# Altium schematic sheet demoBoard.SchDoc
size A4; SheetNumber: 1; SheetTotal: 1; SPICEModelCacheLQNEOJUH: <root> / <DocumentId>LQNEOJUH</DocumentId> / </root>
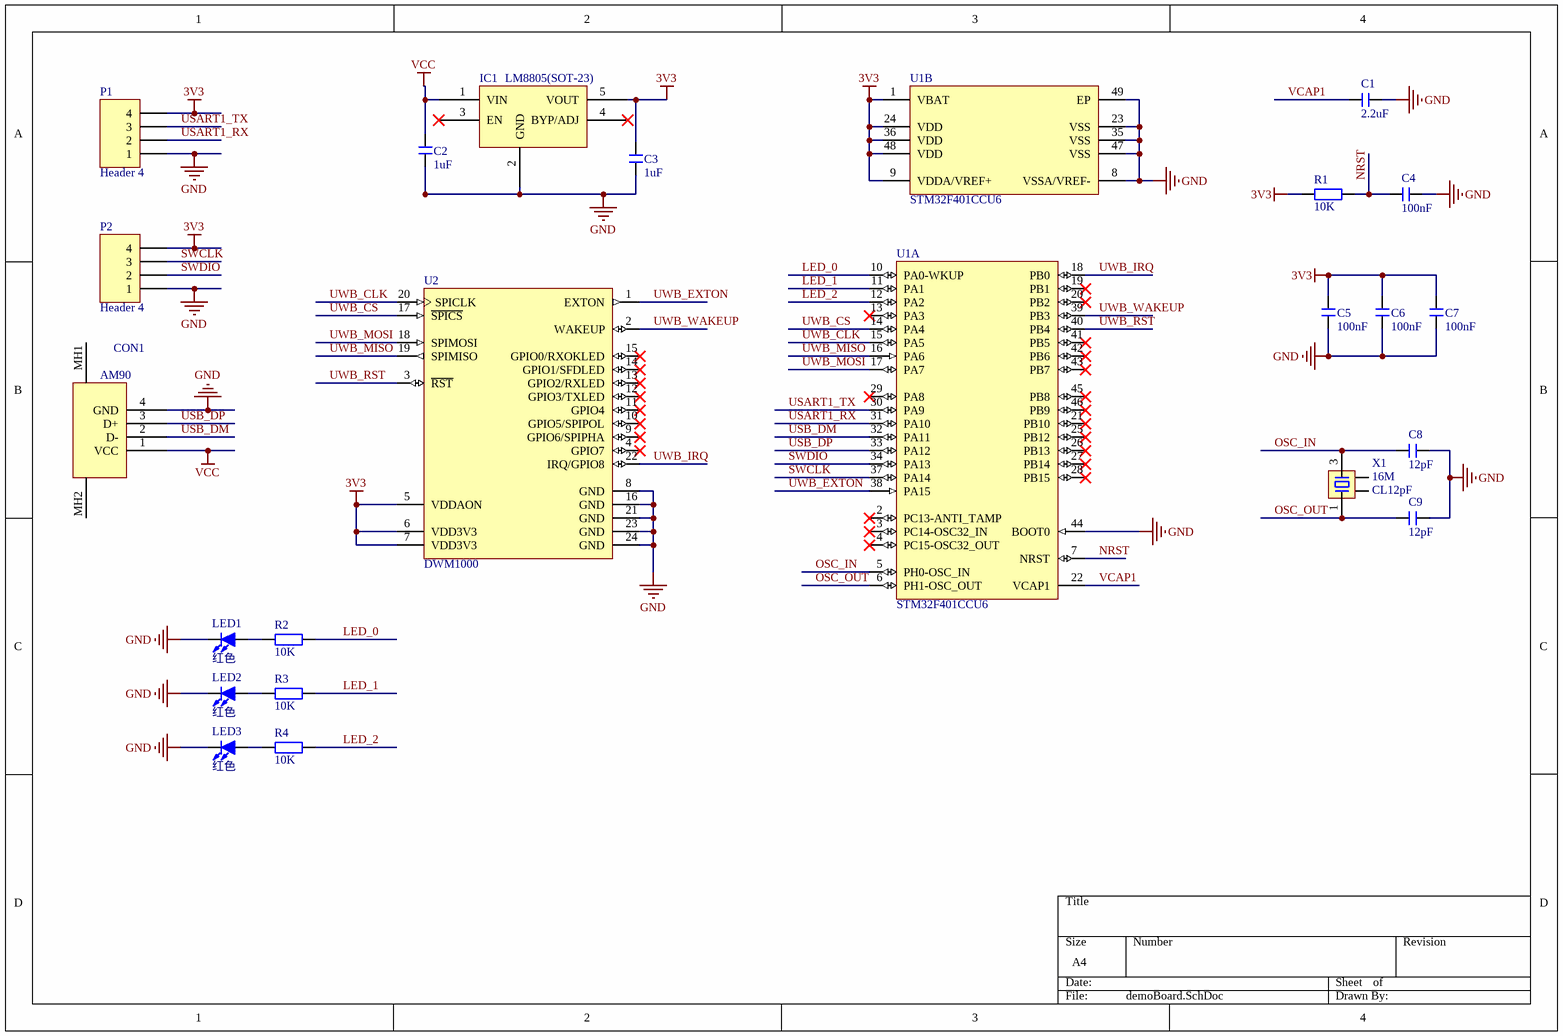
[diagram p0: demoBoard.SchDoc]

## Parts
C1  2.2uF  [C 0603_L]
C2  1uF  [C 0603_L]
C3  1uF  [C 0603_L]
C4  100nF  [C 0603_L]
C5  100nF  [C 0603_L]
C6  100nF  [C 0603_L]
C7  100nF  [C 0603_L]
C8  12pF  [C 0603_L]
C9  12pF  [C 0603_L]
CON1  AM90  [USB-AM-TH_AM90]
IC1  LM8805(SOT-23)  [SOT23-5N]
LED1  红色  [LED 0603G]
LED2  红色  [LED 0603G]
LED3  红色  [LED 0603G]
P1  Header 4  [MX 1.25-WS-4P]
P2  Header 4  [MX 1.25-WS-4P]
R1  10K  [R 0603_L]
R2  10K  [R 0603_L]
R3  10K  [R 0603_L]
R4  10K  [R 0603_L]
U1  STM32F401CCU6  [STM-UFQFPN48_N]  (parts A,B of 2)
U2  DWM1000  [DECW-DWM1000-24_V]
X1  16M  负载电容: CL12pF  [OSC 3225-4P]

## Nets
3V3: C3.2 C5.2 C6.2 C7.2 IC1.5(VOUT) P1.4 P2.4 R1.1 U1.1(VBAT) U1.9(VDDA/VREF+) U1.24(VDD) U1.36(VDD) U1.48(VDD) U2.5(VDDAON) U2.6(VDD3V3) U2.7(VDD3V3)
GND: C1.2 C2.1 C3.1 C4.1 C5.1 C6.1 C7.1 C8.2 C9.2 CON1.4(GND) IC1.2(GND) LED1.2(K) LED2.2(K) LED3.2(K) P1.1 P2.1 U1.8(VSSA/VREF-) U1.23(VSS) U1.35(VSS) U1.44(BOOT0) U1.47(VSS) U1.49(EP) U2.8(GND) U2.16(GND) U2.21(GND) U2.23(GND) U2.24(GND)
VCC: C2.2 CON1.1(VCC) IC1.1(VIN)
LED_0: R2.2 U1.10(PA0-WKUP)
LED_1: R3.2 U1.11(PA1)
LED_2: R4.2 U1.12(PA2)
NRST: C4.2 R1.2 U1.7(NRST)
OSC_IN: C8.1 U1.5(PH0-OSC_IN) X1.3
OSC_OUT: C9.1 U1.6(PH1-OSC_OUT) X1.1
SWCLK: P2.3 U1.37(PA14)
SWDIO: P2.2 U1.34(PA13)
USART1_RX: P1.2 U1.31(PA10)
USART1_TX: P1.3 U1.30(PA9)
USB_DM: CON1.2(D-) U1.32(PA11)
USB_DP: CON1.3(D+) U1.33(PA12)
UWB_CLK: U1.15(PA5) U2.20(SPICLK)
UWB_CS: U1.14(PA4) U2.17(~{SPICS})
UWB_EXTON: U1.38(PA15) U2.1(EXTON)
UWB_IRQ: U1.18(PB0) U2.22(IRQ/GPIO8)
UWB_MISO: U1.16(PA6) U2.19(SPIMISO)
UWB_MOSI: U1.17(PA7) U2.18(SPIMOSI)
UWB_RST: U1.40(PB4) U2.3(~{RST})
UWB_WAKEUP: U1.39(PB3) U2.2(WAKEUP)
VCAP1: C1.1 U1.22(VCAP1)
NetLED1_1: LED1.1(A) R2.1
NetLED2_1: LED2.1(A) R3.1
NetLED3_1: LED3.1(A) R4.1

Not connected (* = marked no-connect by the designer): CON1 MH1 MH2; IC1 3(EN)* 4(BYP/ADJ)*; U1 2(PC13-ANTI_TAMP)* 3(PC14-OSC32_IN)* 4(PC15-OSC32_OUT)* 13(PA3)* 19(PB1)* 20(PB2)* 21(PB10)* 25(PB12)* 26(PB13)* 27(PB14)* 28(PB15)* 29(PA8)* 41(PB5)* 42(PB6)* 43(PB7)* 45(PB8)* 46(PB9)*; U2 4(GPIO7)* 9(GPIO6/SPIPHA)* 10(GPIO5/SPIPOL)* 11(GPIO4)* 12(GPIO3/TXLED)* 13(GPIO2/RXLED)* 14(GPIO1/SFDLED)* 15(GPIO0/RXOKLED)*; X1 2 4

## Library data of the parts
C1-C9 = C: 无极性贴片电容; 版权归属: 源创客; 材质: X7R; BOM名称: 无极性贴片电容; 学习资源: www.ooocke.com
IC1 = LM8805(SOT-23): 600mA CMOS L.D.O. Regulator
LED1-LED3 = LED-SMD: 贴片LED; 版权归属: 源创客; BOM名称: 贴片LED; 学习资源: www.ooocke.com
P1 P2 = Header 4: Header, 4-Pin; LatestRevisionDate: 17-Jul-2002; LatestRevisionNote: Re-released for DXP Platform.; Publisher: Altium Limited
R1-R4 = R: 贴片电阻; 版权归属: 源创客; BOM名称: 贴片电阻; 学习资源: www.ooocke.com
U1 = CMP-0243-00119-2: ARM Cortex-M4 32-bit MCU+FPU, 105 DMIPS, 256 kB Flash, 64 kB Internal RAM, 36 I/Os, 48-pin UFQFPN, -40 to 85 degC, Tray; Manufacturer: STMicroelectronics; Supply Voltage(Vcc) max (V): 3.6; I/Os (High Current): 36; Internal RAM Size (kB): 64; Operating Frequency(F) (Processor speed) (MHz): 84; FLASH Size (Prog) (kB): 256; Supply Voltage(Vcc) min (V): 1.8; Packing: Tray; PackageReference: UFQFPN48; PackageVersion: Rev. 1, 04/2013; Core: ARM Cortex-M4; ComponentLink1Description: Manufacturer URL; ComponentLink3Description: Package Specification; PackageDescription: 48-Pin Ultra Thin Fine Pitch Quad Flat No-Lead, 7 x 7 x 0.6 mm Body, 0.5 mm Pitch, Exposed Pad; Mounting Technology: Surface Mount; ComponentLink2URL: http://www.st.com/st-web-ui/static/active/en/resource/technical/document/data_brief/DM00071938.pdf; DatasheetVersion: Rev. 1; ComponentLink2Description: Datasheet; ComponentLink1URL: http://www.st.com/web/en/home.html; PartNumber: STM32F401CCU6; ComponentLink3URL: http://www.st.com/st-web-ui/static/active/en/resource/technical/document/data_brief/DM00071938.pdf
U2 = CMP-2000-05094-1: DW M1000 IEEE 802.15.4 -2011 UWB Transceiver Module; Manufacturer: Decawave; Voltage - Supply: 2.8V~3.6V; Protocol: IR-UWB; Featured Product: ScenSorDWM1000Module; Design Resources: DevelopmentToolSelector; Frequency: 3.5GHz~6.5GHz; Antenna Type: Integrated,Chip; Other Names: 1479-1002-2RUPF-G001A; Current - Receiving: 64mA; Data Rate: 6.8Mbps; Serial Interfaces: SPI; Current - Transmitting: 31mA; Modulation: BPM,BPSK; Standard Package: 500; Series: -; RF Family/Standard: 802.15.4; Operating Temperature: -40degC~85degC; Sensitivity: -; Packaging: Tape&Reel(TR); Datasheet Version: Rev. V1.0, 12/2015; Power - Output: -; Family: RFTransceiverModules; Memory Size: -; Package / Case: Module; Mounting Type: SurfaceMount; Datasheet URL: http://www.decawave.com/sites/default/files/resources/dwm1000-datasheet-v1.3.pdf; Online Catalog: ScenSorDWM1000Module; Category: RF/IFandRFID; Manufacturer URL: http://www.decawave.com/
X1 = XTAL-4P: 4脚无源晶振; 版权归属: 源创客; BOM名称: 4脚无源晶振; 学习资源: www.ooocke.com